# EAGLE schematic test (EAGLE 8.3.2)
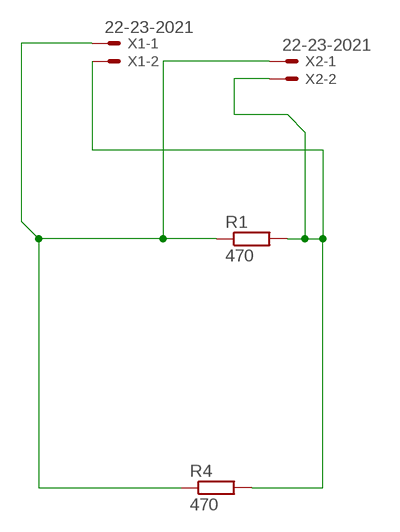
[diagram p0: schematic, sheet 1]

## Parts
R1  470  R-EU_0207/10  [0207/10]
R4  470  R-EU_0207/10  [0207/10]
X1  22-23-2021  [22-23-2021]
X2  22-23-2021  [22-23-2021]

## Nets
N$1: R1.2 R4.2 X1.2 X2.2
N$3: R1.1 R4.1 X1.1 X2.1

## Library data of the parts
R1 R4 = resistor:R-EU_: RESISTOR, European symbol
X1 X2 = con-molex:22-23-2021: .100" (2.54mm) Center Header - 2 Pin; MF: MOLEX; MPN: 22-23-2021; OC_FARNELL: 1462926; OC_NEWARK: 25C3832